# Altium schematic sheet CTRL_LOGIC.SchDoc: CPLD logic
size 420 x 297 mm; Author: G.K.; CompanyName: WUT; DrawnBy: G.K.; Organization: WUT ISE; Address1: Warsaw Univeristy of Technology; Address2: Nowowiejska 15/19; DocumentNumber: 7; SheetNumber: 7; SheetTotal: 7; EDA_Number: ARTIQ; Projet: ARTIQ/SINARA; ModifiedBy: -; CreateDate: XX/XX/XXXX; CheckedDate: -; Title2: & option switches; DivGrp: ISE; Designer: G.K.; ModifiedDate: -; ProjectName: ARTIQ/SINARA
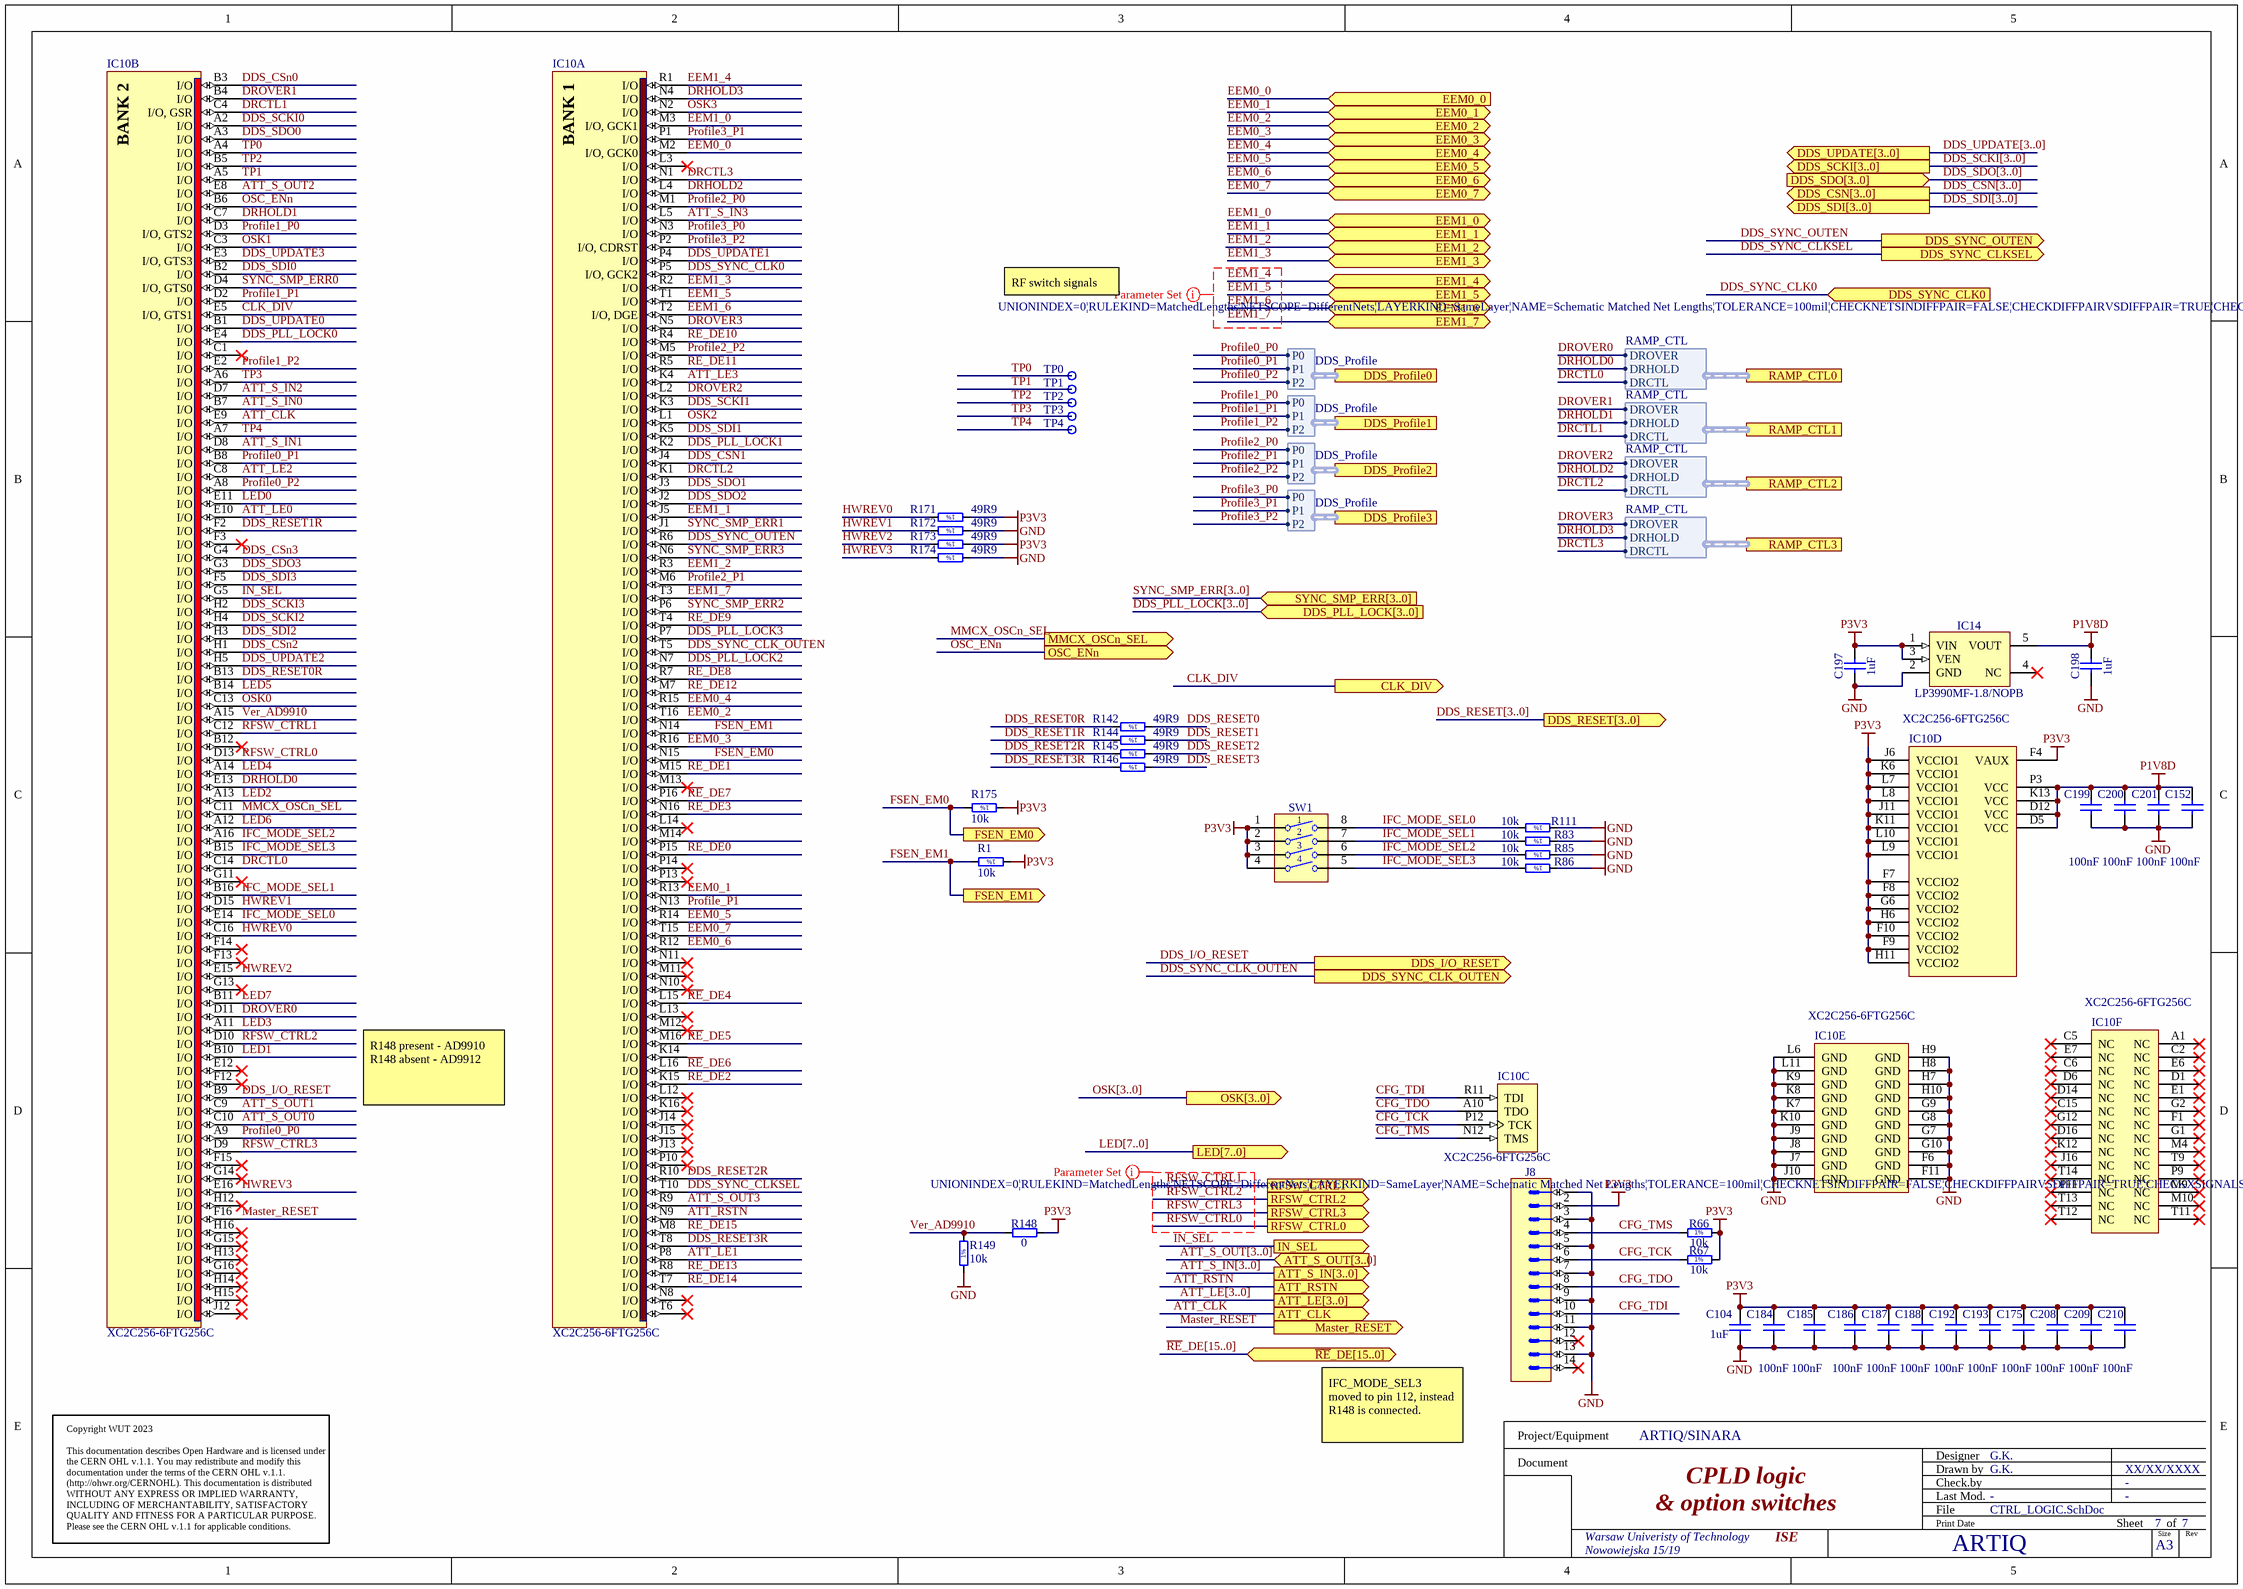
[diagram p0: CTRL_LOGIC.SchDoc]

## Parts
C104  1uF  [CAPC1005X55N]
C152  100nF  [CAPC1005X55N]
C175  100nF  [CAPC1005X55N]
C184  100nF  [CAPC1005X55N]
C185  100nF  [CAPC1005X55N]
C186  100nF  [CAPC1005X55N]
C187  100nF  [CAPC1005X55N]
C188  100nF  [CAPC1005X55N]
C192  100nF  [CAPC1005X55N]
C193  100nF  [CAPC1005X55N]
C197  1uF  [CAPC1005X55N]
C198  1uF  [CAPC1005X55N]
C199  100nF  [CAPC1005X55N]
C200  100nF  [CAPC1005X55N]
C201  100nF  [CAPC1005X55N]
C208  100nF  [CAPC1005X55N]
C209  100nF  [CAPC1005X55N]
C210  100nF  [CAPC1005X55N]
IC10  XC2C256-6FTG256C  [FTG256]  (parts A,B,C,D,E,F of 6)
IC14  LP3990MF-1.8/NOPB  [SOT95P284X122-5N]
J8  Milli-Grid™  [MOLEX_87832-1420]  (value not drawn)
R1  10k  [RESC1005X40N]
R66  10k  [RESC1005X40N]
R67  10k  [RESC1005X40N]
R83  10k  [RESC1005X40N]
R85  10k  [RESC1005X40N]
R86  10k  [RESC1005X40N]
R111  10k  [RESC1005X40N]
R142  49R9  [RESC1005X40N]
R144  49R9  [RESC1005X40N]
R145  49R9  [RESC1005X40N]
R146  49R9  [RESC1005X40N]
R148  0  [RESC1005X40N]
R149  10k  [RESC1005X40N]
R171  49R9  [RESC1005X40N]
R172  49R9  [RESC1005X40N]
R173  49R9  [RESC1005X40N]
R174  49R9  [RESC1005X40N]
R175  10k  [RESC1005X40N]
SW1  Switch  [SW_OMRON_A6S-4102-H]  (value not drawn)
TP0  Test Point  [TPS127]  (value not drawn)
TP1  Test Point  [TPS127]  (value not drawn)
TP2  Test Point  [TPS127]  (value not drawn)
TP3  Test Point  [TPS127]  (value not drawn)
TP4  Test Point  [TPS127]  (value not drawn)

## Ports
ATT_CLK (out), ATT_LE[3..0] (out), ATT_RSTN (out), ATT_S_IN[3..0] (out), ATT_S_OUT[3..0] (in), CLK_DIV (out), DDS_CSN[3..0] (out), DDS_I/O_RESET (out), DDS_PLL_LOCK[3..0] (in), DDS_Profile0 (harness DDS_Profile), DDS_Profile1 (harness DDS_Profile), DDS_Profile2 (harness DDS_Profile), DDS_Profile3 (harness DDS_Profile), DDS_RESET[3..0] (out), DDS_SCKI[3..0] (out), DDS_SDI[3..0] (out), DDS_SDO[3..0] (in), DDS_SYNC_CLK0 (in), DDS_SYNC_CLK_OUTEN (out), DDS_SYNC_CLKSEL (out), DDS_SYNC_OUTEN (out), DDS_UPDATE[3..0] (out), EEM0_0 (in), EEM0_1 (bidir), EEM0_2 (bidir), EEM0_3 (bidir), EEM0_4 (bidir), EEM0_5 (bidir), EEM0_6 (bidir), EEM0_7 (bidir), EEM1_0 (bidir), EEM1_1 (bidir), EEM1_2 (bidir), EEM1_3 (bidir), EEM1_4 (bidir), EEM1_5 (bidir), EEM1_6 (bidir), EEM1_7 (bidir), FSEN_EM0 (out), FSEN_EM1 (out), IN_SEL (out), LED[7..0] (out), Master_RESET (out), MMCX_OSCn_SEL (out), OSC_ENn (out), OSK[3..0] (out), RAMP_CTL0 (harness RAMP_CTL), RAMP_CTL1 (harness RAMP_CTL), RAMP_CTL2 (harness RAMP_CTL), RAMP_CTL3 (harness RAMP_CTL), RFSW_CTRL0 (out), RFSW_CTRL1 (out), RFSW_CTRL2 (out), RFSW_CTRL3 (out), SYNC_SMP_ERR[3..0] (in), ~{RE}_DE[15..0] (bidir)

## Harnesses
DDS_Profile: P0, P1, P2
RAMP_CTL: DROVER, DRHOLD, DRCTL

## Nets
GND: C104.1 C152.1 C175.1 C184.1 C185.1 C186.1 C187.1 C188.1 C192.1 C193.1 C197.1 C198.1 C199.1 C200.1 C201.1 C208.1 C209.1 C210.1 IC10.F6(GND) IC10.F11(GND) IC10.G7(GND) IC10.G8(GND) IC10.G9(GND) IC10.G10(GND) IC10.H7(GND) IC10.H8(GND) IC10.H9(GND) IC10.H10(GND) IC10.J7(GND) IC10.J8(GND) IC10.J9(GND) IC10.J10(GND) IC10.K7(GND) IC10.K8(GND) IC10.K9(GND) IC10.K10(GND) IC10.L6(GND) IC10.L11(GND) IC14.2(GND) J8.1 J8.3 J8.5 J8.7 J8.9 J8.11 J8.13 R83.1 R85.1 R86.1 R111.1 R149.1 R172.1 R174.1
P1V8D: C152.2 C198.2 C199.2 C200.2 C201.2 IC10.D5(VCC) IC10.D12(VCC) IC10.K13(VCC) IC10.P3(VCC) IC14.5(VOUT)
P3V3: C104.2 C175.2 C184.2 C185.2 C186.2 C187.2 C188.2 C192.2 C193.2 C197.2 C208.2 C209.2 C210.2 IC10.F4(VAUX) IC10.F7(VCCIO2) IC10.F8(VCCIO2) IC10.F9(VCCIO2) IC10.F10(VCCIO2) IC10.G6(VCCIO2) IC10.H6(VCCIO2) IC10.H11(VCCIO2) IC10.J6(VCCIO1) IC10.J11(VCCIO1) IC10.K6(VCCIO1) IC10.K11(VCCIO1) IC10.L7(VCCIO1) IC10.L8(VCCIO1) IC10.L9(VCCIO1) IC10.L10(VCCIO1) IC14.1(VIN) IC14.3(VEN) J8.2 R1.1 R66.2 R67.2 R148.2 R171.1 R173.1 R175.1 SW1.1 SW1.2 SW1.3 SW1.4
ATT_CLK: IC10.E9(I/O) ; port ATT_CLK
ATT_LE0: IC10.E10(I/O)
ATT_LE1: IC10.P8(I/O)
ATT_LE2: IC10.C8(I/O)
ATT_LE3: IC10.K4(I/O)
ATT_RSTN: IC10.N9(I/O) ; port ATT_RSTN
ATT_S_IN0: IC10.B7(I/O)
ATT_S_IN1: IC10.D8(I/O)
ATT_S_IN2: IC10.D7(I/O)
ATT_S_IN3: IC10.L5(I/O)
ATT_S_OUT0: IC10.C10(I/O)
ATT_S_OUT1: IC10.C9(I/O)
ATT_S_OUT2: IC10.E8(I/O)
ATT_S_OUT3: IC10.R9(I/O)
CFG_TCK: IC10.P12(TCK) J8.6 R67.1
CFG_TDI: IC10.R11(TDI) J8.10
CFG_TDO: IC10.A10(TDO) J8.8
CFG_TMS: IC10.N12(TMS) J8.4 R66.1
CLK_DIV: IC10.E5(I/O,_GTS1) ; port CLK_DIV
DDS_CSn0: IC10.B3(I/O)
DDS_CSN1: IC10.J4(I/O)
DDS_CSn2: IC10.H1(I/O)
DDS_CSn3: IC10.G4(I/O)
DDS_I/O_RESET: IC10.B9(I/O) ; port DDS_I/O_RESET
DDS_PLL_LOCK0: IC10.E4(I/O)
DDS_PLL_LOCK1: IC10.K2(I/O)
DDS_PLL_LOCK2: IC10.N7(I/O)
DDS_PLL_LOCK3: IC10.P7(I/O)
DDS_RESET0: R142.1
DDS_RESET0R: IC10.B13(I/O) R142.2
DDS_RESET1: R144.1
DDS_RESET1R: IC10.F2(I/O) R144.2
DDS_RESET2: R145.1
DDS_RESET2R: IC10.R10(I/O) R145.2
DDS_RESET3: R146.1
DDS_RESET3R: IC10.T8(I/O) R146.2
DDS_SCKI0: IC10.A2(I/O)
DDS_SCKI1: IC10.K3(I/O)
DDS_SCKI2: IC10.H4(I/O)
DDS_SCKI3: IC10.H2(I/O)
DDS_SDI0: IC10.B2(I/O)
DDS_SDI1: IC10.K5(I/O)
DDS_SDI2: IC10.H3(I/O)
DDS_SDI3: IC10.F5(I/O)
DDS_SDO0: IC10.A3(I/O)
DDS_SDO1: IC10.J3(I/O)
DDS_SDO2: IC10.J2(I/O)
DDS_SDO3: IC10.G3(I/O)
DDS_SYNC_CLK0: IC10.P5(I/O,_GCK2) ; port DDS_SYNC_CLK0
DDS_SYNC_CLK_OUTEN: IC10.T5(I/O) ; port DDS_SYNC_CLK_OUTEN
DDS_SYNC_CLKSEL: IC10.T10(I/O) ; port DDS_SYNC_CLKSEL
DDS_SYNC_OUTEN: IC10.R6(I/O) ; port DDS_SYNC_OUTEN
DDS_UPDATE0: IC10.B1(I/O)
DDS_UPDATE1: IC10.P4(I/O)
DDS_UPDATE2: IC10.H5(I/O)
DDS_UPDATE3: IC10.E3(I/O,_GTS3)
DRCTL0: IC10.C14(I/O) ; port RAMP_CTL0.DRCTL
DRCTL1: IC10.C4(I/O,_GSR) ; port RAMP_CTL1.DRCTL
DRCTL2: IC10.K1(I/O) ; port RAMP_CTL2.DRCTL
DRCTL3: IC10.N1(I/O) ; port RAMP_CTL3.DRCTL
DRHOLD0: IC10.E13(I/O) ; port RAMP_CTL0.DRHOLD
DRHOLD1: IC10.C7(I/O) ; port RAMP_CTL1.DRHOLD
DRHOLD2: IC10.L4(I/O) ; port RAMP_CTL2.DRHOLD
DRHOLD3: IC10.N4(I/O) ; port RAMP_CTL3.DRHOLD
DROVER0: IC10.D11(I/O) ; port RAMP_CTL0.DROVER
DROVER1: IC10.B4(I/O) ; port RAMP_CTL1.DROVER
DROVER2: IC10.L2(I/O) ; port RAMP_CTL2.DROVER
DROVER3: IC10.N5(I/O) ; port RAMP_CTL3.DROVER
EEM0_0: IC10.M2(I/O,_GCK0) ; port EEM0_0
EEM0_1: IC10.R13(I/O) ; port EEM0_1
EEM0_2: IC10.T16(I/O) ; port EEM0_2
EEM0_3: IC10.R16(I/O) ; port EEM0_3
EEM0_4: IC10.R15(I/O) ; port EEM0_4
EEM0_5: IC10.R14(I/O) ; port EEM0_5
EEM0_6: IC10.R12(I/O) ; port EEM0_6
EEM0_7: IC10.T15(I/O) ; port EEM0_7
EEM1_0: IC10.M3(I/O,_GCK1) ; port EEM1_0
EEM1_1: IC10.J5(I/O) ; port EEM1_1
EEM1_2: IC10.R3(I/O) ; port EEM1_2
EEM1_3: IC10.R2(I/O) ; port EEM1_3
EEM1_4: IC10.R1(I/O) ; port EEM1_4
EEM1_5: IC10.T1(I/O) ; port EEM1_5
EEM1_6: IC10.T2(I/O,_DGE) ; port EEM1_6
EEM1_7: IC10.T3(I/O) ; port EEM1_7
FSEN_EM0: IC10.N15(I/O) R175.2 ; port FSEN_EM0
FSEN_EM1: IC10.N14(I/O) R1.2 ; port FSEN_EM1
HWREV0: IC10.C16(I/O) R171.2
HWREV1: IC10.D15(I/O) R172.2
HWREV2: IC10.E15(I/O) R173.2
HWREV3: IC10.E16(I/O) R174.2
IFC_MODE_SEL0: IC10.E14(I/O) R111.2 SW1.8
IFC_MODE_SEL1: IC10.B16(I/O) R83.2 SW1.7
IFC_MODE_SEL2: IC10.A16(I/O) R85.2 SW1.6
IFC_MODE_SEL3: IC10.B15(I/O) R86.2 SW1.5
IN_SEL: IC10.G5(I/O) ; port IN_SEL
LED0: IC10.E11(I/O)
LED1: IC10.B10(I/O)
LED2: IC10.A13(I/O)
LED3: IC10.A11(I/O)
LED4: IC10.A14(I/O)
LED5: IC10.B14(I/O)
LED6: IC10.A12(I/O)
LED7: IC10.B11(I/O)
Master_RESET: IC10.F16(I/O) ; port Master_RESET
MMCX_OSCn_SEL: IC10.C11(I/O) ; port MMCX_OSCn_SEL
OSC_ENn: IC10.B6(I/O) ; port OSC_ENn
OSK0: IC10.C13(I/O)
OSK1: IC10.C3(I/O)
OSK2: IC10.L1(I/O)
OSK3: IC10.N2(I/O)
Profile0_P0: IC10.A9(I/O) ; port DDS_Profile0.P0
Profile0_P1: IC10.B8(I/O) ; port DDS_Profile0.P1
Profile0_P2: IC10.A8(I/O) ; port DDS_Profile0.P2
Profile1_P0: IC10.D3(I/O,_GTS2) ; port DDS_Profile1.P0
Profile1_P1: IC10.D2(I/O) ; port DDS_Profile1.P1
Profile1_P2: IC10.E2(I/O) ; port DDS_Profile1.P2
Profile2_P0: IC10.M1(I/O) ; port DDS_Profile2.P0
Profile2_P1: IC10.M6(I/O) ; port DDS_Profile2.P1
Profile2_P2: IC10.M5(I/O) ; port DDS_Profile2.P2
Profile3_P0: IC10.N3(I/O) ; port DDS_Profile3.P0
Profile3_P1: IC10.P1(I/O) ; port DDS_Profile3.P1
Profile3_P2: IC10.P2(I/O,_CDRST) ; port DDS_Profile3.P2
Profile_P1: IC10.N13(I/O)
~{RE}_DE0: IC10.P15(I/O)
~{RE}_DE1: IC10.M15(I/O)
~{RE}_DE2: IC10.K15(I/O)
~{RE}_DE3: IC10.N16(I/O)
~{RE}_DE4: IC10.L15(I/O)
~{RE}_DE5: IC10.M16(I/O)
~{RE}_DE6: IC10.L16(I/O)
~{RE}_DE7: IC10.P16(I/O)
~{RE}_DE8: IC10.R7(I/O)
~{RE}_DE9: IC10.T4(I/O)
~{RE}_DE10: IC10.R4(I/O)
~{RE}_DE11: IC10.R5(I/O)
~{RE}_DE12: IC10.M7(I/O)
~{RE}_DE13: IC10.R8(I/O)
~{RE}_DE14: IC10.T7(I/O)
~{RE}_DE15: IC10.M8(I/O)
RFSW_CTRL0: IC10.D13(I/O) ; port RFSW_CTRL0
RFSW_CTRL1: IC10.C12(I/O) ; port RFSW_CTRL1
RFSW_CTRL2: IC10.D10(I/O) ; port RFSW_CTRL2
RFSW_CTRL3: IC10.D9(I/O) ; port RFSW_CTRL3
SYNC_SMP_ERR0: IC10.D4(I/O,_GTS0)
SYNC_SMP_ERR1: IC10.J1(I/O)
SYNC_SMP_ERR2: IC10.P6(I/O)
SYNC_SMP_ERR3: IC10.N6(I/O)
TP0: IC10.A4(I/O) TP0.1
TP1: IC10.A5(I/O) TP1.1
TP2: IC10.B5(I/O) TP2.1
TP3: IC10.A6(I/O) TP3.1
TP4: IC10.A7(I/O) TP4.1
Ver_AD9910: IC10.A15(I/O) R148.1 R149.2

Not connected (* = marked no-connect by the designer): IC10 A1(NC)* B12(I/O)* C1(I/O)* C2(NC)* C5(NC)* C6(NC)* C15(NC)* D1(NC)* D6(NC)* D14(NC)* D16(NC)* E1(NC)* E6(NC)* E7(NC)* E12(I/O)* F1(NC)* F3(I/O)* F12(I/O)* F13(I/O)* F14(I/O)* F15(I/O)* G1(NC)* G2(NC)* G11(I/O)* G12(NC)* G13(I/O)* G14(I/O)* G15(I/O)* G16(I/O)* H12(I/O)* H13(I/O)* H14(I/O)* H15(I/O)* H16(I/O)* J12(I/O)* J13(I/O)* J14(I/O)* J15(I/O)* J16(NC)* K12(NC)* K14(I/O) K16(I/O)* L3(I/O)* L12(I/O)* L13(I/O)* L14(I/O)* M4(NC)* M9(NC)* M10(NC)* M11(I/O)* M12(I/O)* M13(I/O)* M14(I/O) N8(I/O)* N10(I/O)* N11(I/O)* P9(NC)* P10(I/O)* P11(NC)* P13(I/O)* P14(I/O)* T6(I/O)* T9(NC)* T11(NC)* T12(NC)* T13(NC)* T14(NC)*; IC14 4(NC)*; J8 12* 14*

## Buses and harness runs
bus ATT_LE[3..0] = port ATT_LE[3..0]
bus ATT_S_IN[3..0] = port ATT_S_IN[3..0]
bus ATT_S_OUT[3..0] = port ATT_S_OUT[3..0]
bus DDS_CSN[3..0] = port DDS_CSN[3..0]
bus DDS_PLL_LOCK[3..0] = port DDS_PLL_LOCK[3..0]
bus DDS_RESET[3..0] = port DDS_RESET[3..0]
bus DDS_SCKI[3..0] = port DDS_SCKI[3..0]
bus DDS_SDI[3..0] = port DDS_SDI[3..0]
bus DDS_SDO[3..0] = port DDS_SDO[3..0]
bus DDS_UPDATE[3..0] = port DDS_UPDATE[3..0]
bus LED[7..0] = port LED[7..0]
bus OSK[3..0] = port OSK[3..0]
bus SYNC_SMP_ERR[3..0] = port SYNC_SMP_ERR[3..0]
bus ~{RE}_DE[15..0] = port ~{RE}_DE[15..0]

## Layout directives
rule Matched Net Lengths [Tolerance = 2.54mm]; net class RFSW_CPLD: EEM1_4, EEM1_5, EEM1_6, EEM1_7
rule Matched Net Lengths [Tolerance = 2.54mm]; net class RFSW: RFSW_CTRL0, RFSW_CTRL1, RFSW_CTRL2, RFSW_CTRL3

## Notes on the sheet
- RF switch signals
- R148 present - AD9910
  R148 absent - AD9912
- IFC_MODE_SEL3 moved to pin 112, instead R148 is connected.
- Copyright WUT 2023
  This documentation describes Open Hardware and is licensed under the CERN OHL v.1.1. You may redistribute and modify this documentation under the terms of the CERN OHL v.1.1. (http://ohwr.org/CERNOHL). This documentation is distributed WITHOUT ANY EXPRESS OR IMPLIED WARRANTY, INCLUDING OF MERCHANTABILITY, SATISFACTORY QUALITY AND FITNESS FOR A PARTICULAR PURPOSE. Please see the CERN OHL v.1.1 for applicable conditions.
- Project/Equipment
- Document
- Designer
- Drawn by
- Check.by
- File
- Last Mod.
- Print Date
- Sheet
- Size
- A3
- of
- Rev
- (in symbol CMP-0087-00009-1, part A) BANK 1
- (in symbol CMP-0087-00009-1, part B) BANK 2
- (in symbol R0402_10K_1%_0.0625W_100PPM) 1%
- (in symbol R0402_49R9_1%_0.0625W_100PPM) 1%

## Library data of the parts
C104 C197 C198 = CC0402_1UF_16V_10%_X5R: Non-polarised capacitor; Part Description: SMD Multilayer Chip Ceramic Capacitor; Manufacturer: GENERIC; Manufacturer1 Part Number: C1005X5R1C105KT; Voltage: 16V; TC: X5R; Tolerance: ±10%; Part Number: CC0402_1UF_16V_10%_X5R; Component Kind: Standard; Component Type: Standard; Pin Count: 2; Value: 1uF; Status: Preferred; Manufacturer Part Number: CC0402_1UF_16V_10%_X5R; Case: 0402; Mounted: Yes; Socket: No; SMD: Yes; Sense: No; Manufacturer1 Example: TDK; Manufacturer1 ComponentHeight: 0.55mm; HelpURL: \\cern.ch\dfs\Applications\Altium\Datasheets\CC0402_X5R_TDK_C.pdf; Author: CERN DEM JLC; CreateDate: 2012-10-25; LatestRevisionDate: 2012-10-25
C152 C175 C184-C188 C192 C193 C199-C201 C208-C210 = CC0402_100NF_16V_10%_X5R: Non-polarised capacitor; Part Description: SMD Multilayer Chip Ceramic Capacitor; Manufacturer: GENERIC; Manufacturer1 Part Number: GRM155R61C104KA88D; Voltage: 16V; TC: X5R; Tolerance: ±10%; Part Number: CC0402_100NF_16V_10%_X5R; Component Kind: Standard; Component Type: Standard; Pin Count: 2; Value: 100nF; Status: None; Manufacturer Part Number: CC0402_100NF_16V_10%_X5R; Case: 0402; Mounted: Yes; Socket: No; SMD: Yes; Sense: No; Manufacturer1 Example: MURATA; Manufacturer1 ComponentHeight: 0.55mm; HelpURL: \\cern.ch\dfs\Applications\Altium\Datasheets\CC0402_X5R_MURATA_GRM.pdf; Author: CERN DEM JLC; CreateDate: 10.12.2013; LatestRevisionDate: 10.12.2013
IC10 = CMP-0087-00009-1: CoolRunner-II 1.8V, 256 Macrocell CPLD, 184 User I/Os, 256-Ball FTBGA, Commercial Grade, Pb-Free; PackageReference: FTG256; PackageDescription: 256-Ball Fine Pitch Thin Ball Grid Array 1.00 mm Pitch (FTG256) - Pb-Free; DatasheetVersion: ver3.2, Mar-2007; PackageVersion: ver1.3, Oct-2007; Code_JEDEC: MS-034-AAF-1*
IC14 = LP3990MF-1.8/NOPB: 1.8V, 150mA Linear Voltage Regulator For Digital Applications; Manufacturer: TEXAS INSTRUMENTS; PressFit: No; Bonding: No; Part Number: LP3990MF-1.8/NOPB; Component Kind: Standard; Component Type: Standard; Device: LP3990MF-1.8/NOPB; PackageDescription: SOT23 5, Pitch 0.95mm - Body 1.67x2.99mm, IPC Medium Density; Part Description: 1.8V, 150mA Linear Voltage Regulator For Digital Applications; Manufacturer Part Number: LP3990MF-1.8/NOPB; Pin Count: 5; Case: SOT23-5; Mounted: Yes; Socket: No; SMD: Yes; Sense: No; ComponentHeight: 1.19mm; HelpURL: \\cern.ch\dfs\Applications\Altium\Datasheets\LP3990MF-1.8-NOPB.pdf; Author: CERN DEM JLC; CreateDate: 19.01.2011; LatestRevisionDate: 16.09.2014
J8 = MOLEX_87832-1420: Connector 14 Male; Part Description: 2.00mm (.079") Pitch Milli-Grid™ Header, Surface Mount, Vertical, Shrouded, 14 Circuits,with Locking Windows and Centre Polarization Slot, PCB Locator; Manufacturer: MOLEX; PressFit: No; Part Number: MOLEX_87832-1420; Component Kind: Standard; Component Type: Standard; Pin Count: 14; Family: Milli-Grid™; Mounted: Yes; Socket: No; SMD: Yes; Sense: No; Status: None; Manufacturer Part Number: 87832-1420; ComponentHeight: 7.6mm; HelpURL: \\cern.ch\dfs\Applications\Altium\Datasheets\MOLEX_87832-1420.pdf; Author: CERN DEM JLC; CreateDate: 09.09.2008; LatestRevisionDate: 09.09.2008
R1 R66 R67 R83 R85 R86 R111 R149 R175 = R0402_10K_1%_0.0625W_100PPM: Resistor - 1%; Part Description: General Purpose Thick Film Chip Resistor; Manufacturer: GENERIC; Manufacturer1 Part Number: 232270671003L; TC: ±100ppm/°C; Part Number: R0402_10K_1%_0.0625W_100PPM; Component Kind: Standard; Component Type: Standard; Pin Count: 2; Value: 10k; Status: Not recommended; Power: 0.0625W; Tolerance: ±1%; Manufacturer Part Number: R0402_10K_1%_0.0625W_100PPM; Case: 0402; Mounted: Yes; Sense: No; Socket: No; SMD: Yes; Manufacturer1 Example: YAGEO PHYCOMP; Manufacturer1 ComponentHeight: 0.4mm; HelpURL: \\cern.ch\dfs\Applications\Altium\Datasheets\R0402_Phycomp_RC0402.pdf; Author: CERN DEM JLC; CreateDate: 03.12.2007; LatestRevisionDate: 17.10.2012
R142 R144-R146 R171-R174 = R0402_49R9_1%_0.0625W_100PPM: Resistor - 1%; Part Description: General Purpose Thick Film Chip Resistor; Manufacturer: GENERIC; Manufacturer1 Part Number: 232270674999L or RC0402FR-0749R9L; TC: ±100ppm/°C; PressFit: No; Part Number: R0402_49R9_1%_0.0625W_100PPM; Component Kind: Standard; Component Type: Standard; Pin Count: 2; Value: 49R9; Status: Not Recommended; Power: 0.0625W; Tolerance: ±1%; Manufacturer Part Number: R0402_49R9_1%_0.0625W_100PPM; Case: 0402; Mounted: Yes; Sense: No; Socket: No; SMD: Yes; Manufacturer1 Example: YAGEO PHYCOMP; Manufacturer1 ComponentHeight: 0.4mm; HelpURL: \\cern.ch\dfs\Applications\Altium\Datasheets\R0402_Phycomp_RC0402.pdf; Author: CERN DEM JLC; CreateDate: 24.10.2012; LatestRevisionDate: 24.10.2012
R148 = R0402_0R_JUMPER: Resistor; Part Description: 1A (0.05R Max DC Resistance) Zero Ohm Jumper; Manufacturer: GENERIC; Manufacturer1 Part Number: 232270591001L; Part Number: R0402_0R_JUMPER; Component Kind: Standard; Component Type: Standard; Pin Count: 2; Value: 0; Status: Not recommended; Manufacturer Part Number: R0402_0R_JUMPER; Case: 0402; Mounted: Yes; Sense: No; Socket: No; SMD: Yes; Manufacturer1 Example: YAGEO PHYCOMP; Manufacturer1 ComponentHeight: 0.4mm; HelpURL: \\cern.ch\dfs\Applications\Altium\Datasheets\R0402_Phycomp_RC0402.pdf; Author: CERN DEM JLC; CreateDate: 2007-12-03; LatestRevisionDate: 2012-10-17
SW1 = SW_OMRON_A6S-4102-H: 4 Ways SPST DIP Switch; Part Description: 4 Ways SPST DIP Switch, White Flat Actuator with Seal Tape, Contact Rating 25mA 24VDC; Manufacturer: OMRON; PressFit: No; Part Number: SW_OMRON_A6S-4102-H; Component Kind: Standard; Component Type: Standard; Pin Count: 8; PackageDescription: Pitch 2.54mm, Body 11.3x6.4mm, 4 Ways SPST Surface-Mounting DIP Switch, OMRON A6S-H; Family: Switch; Mounted: Yes; Socket: No; SMD: Yes; Sense: No; Status: None; Manufacturer Part Number: A6S-4102-H; ComponentHeight: 3.8mm; HelpURL: \\cern.ch\dfs\Applications\Altium\Datasheets\SW_OMRON_A6S-4102-H.pdf; Author: CERN DEM JMW; CreateDate: 25.09.2008; LatestRevisionDate: 25.09.2008
TP0-TP4 = SMD_PAD_1.27X1.27MM: Part Description: 1.27mm x 1.27mm PCB Copper Area (SMD Test Point); Mounted: No; Part Number: SMD_PAD_1.27X1.27MM; Component Kind: Standard (No BOM); Component Type: Standard (No BOM); Pin Count: 1; Family: Test Point; Socket: No; SMD: Yes; Sense: No; Status: None; ComponentHeight: 0mm; HelpURL: Undefined; Author: CERN DEM JLC; CreateDate: 12.01.2008; LatestRevisionDate: 12.01.2008; PackageDescription: 1.27mm x 1.27mm PCB Copper Area (SMD Test Point)